# Altium schematic sheet 3s_BMS.SchDoc
size A4; SheetNumber: 1; SheetTotal: 2
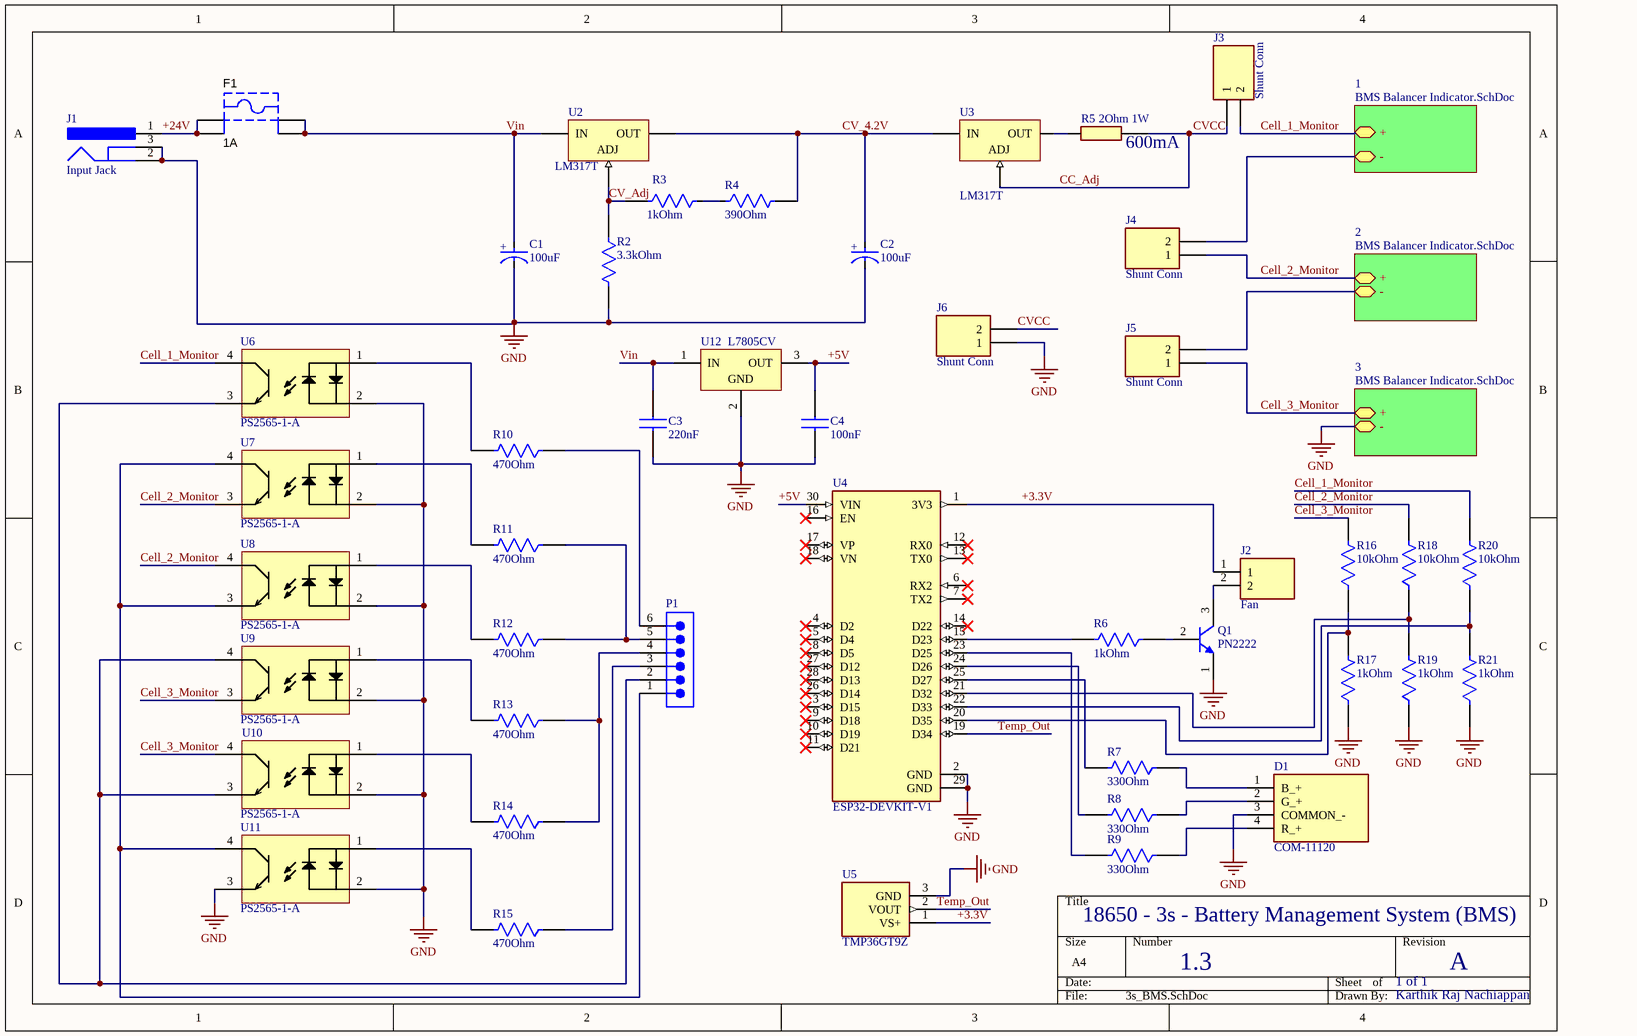
[diagram p0: 3s_BMS.SchDoc]

## Parts
C1  100uF  [FP-RAD-TH-D_8_0_5-L_11_5-MFG]
C2  100uF  [FP-RAD-TH-D_8_0_5-L_11_5-MFG]
C3  220nF  [K224K20X7RF5TH5]
C4  100nF  [C322C104K1R5TA]
D1  COM-11120  [COM11120]
F1  1A  [KSTN-3557-2]
J1  Input Jack  [CUI-PJ-002A_V]
J2  Fan  [HDRV2W67P0X254_1X2_467X234X823P]
J3  Shunt Conn  [HDRV2W67P0X254_1X2_467X234X823P]
J4  Shunt Conn  [HDRV2W67P0X254_1X2_467X234X823P]
J5  Shunt Conn  [HDRV2W67P0X254_1X2_467X234X823P]
J6  Shunt Conn  [HDRV2W67P0X254_1X2_467X234X823P]
P1  (no value)  [SMTC-TSW-106-07-X-S]
Q1  PN2222  [FAIR-TO-92-3]
R2  3.3kOhm  [FP-MRS25-MFG]
R3  1kOhm  [FP-MRS25-MFG]
R4  390Ohm  [FP-MRS25-MFG]
R5  2Ohm 1W  [RESAD1650W63L650D250]
R6  1kOhm  [FP-MRS25-MFG]
R7  330Ohm  [FP-MRS25-MFG]
R8  330Ohm  [FP-MRS25-MFG]
R9  330Ohm  [FP-MRS25-MFG]
R10  470Ohm  [FP-MRS25-MFG]
R11  470Ohm  [FP-MRS25-MFG]
R12  470Ohm  [FP-MRS25-MFG]
R13  470Ohm  [FP-MRS25-MFG]
R14  470Ohm  [FP-MRS25-MFG]
R15  470Ohm  [FP-MRS25-MFG]
R16  10kOhm  [FP-MRS25-MFG]
R17  1kOhm  [FP-MRS25-MFG]
R18  10kOhm  [FP-MRS25-MFG]
R19  1kOhm  [FP-MRS25-MFG]
R20  10kOhm  [FP-MRS25-MFG]
R21  1kOhm  [FP-MRS25-MFG]
U2  LM317T  [TO-220]
U3  LM317T  [TO-220]
U4  ESP32-DEVKIT-V1  [MODULE_ESP32_DEVKIT_V1]
U5  TMP36GT9Z  [TO-92]
U6  PS2565-1-A  [DIP762W50P254L460H455Q4B]
U7  PS2565-1-A  [DIP762W50P254L460H455Q4B]
U8  PS2565-1-A  [DIP762W50P254L460H455Q4B]
U9  PS2565-1-A  [DIP762W50P254L460H455Q4B]
U10  PS2565-1-A  [DIP762W50P254L460H455Q4B]
U11  PS2565-1-A  [DIP762W50P254L460H455Q4B]
U12  L7805CV  [TO220]

## Sub-sheets
1 = BMS Balancer Indicator.SchDoc: + (bidir), - (bidir)
2 = BMS Balancer Indicator.SchDoc: + (bidir), - (bidir)
3 = BMS Balancer Indicator.SchDoc: + (bidir), - (bidir)

## Nets
GND: C1.1(C) C2.1(C) C3.2 C4.2(-) D1.3(COMMON_-) J1.2 J1.3 J6.1 Q1.1(E) R2.2 R17.1 R19.1 R21.1 U4.2(GND) U4.29(GND) U5.3(GND) U6.2(Cathode) U7.2(Cathode) U8.2(Cathode) U9.2(Cathode) U10.2(Cathode) U11.2(Cathode) U11.3(Emitter) U12.2(GND) ; sheet 3/-
+3.3V: J2.1 U4.1(3V3) U5.1(VS+)
+5V: C4.1(+) U4.30(VIN) U12.3(OUT)
+24V: F1.1 F1.2 J1.1
CC_Adj: J3.1 J6.2 R5.2 U3.1(ADJ)  [also labelled CVCC]
Cell_1_Monitor: J3.2 R20.2 U6.4(Collector) ; sheet 1/+
Cell_2_Monitor: J4.1 R18.2 U7.3(Emitter) U8.4(Collector) ; sheet 2/+
Cell_3_Monitor: J5.1 R16.2 U9.3(Emitter) U10.4(Collector) ; sheet 3/+
CV_4.2V: C2.2(A) R4.2 U2.2(OUT) U3.3(IN)
CV_Adj: R2.1 R3.1 U2.1(ADJ)
Temp_Out: U4.19(D34) U5.2(VOUT)
Vin: C1.2(A) C3.1 F1.3 F1.4 U2.3(IN) U12.1(IN)
NetD1_1: D1.1(B_+) R7.1
NetD1_2: D1.2(G_+) R8.1
NetD1_4: D1.4(R_+) R9.1
NetJ2_2: J2.2 Q1.3(C)
NetJ4_2: J4.2 ; sheet 1/-
NetJ5_2: J5.2 ; sheet 2/-
NetP1_1: P1.1 U7.4(Collector) U8.3(Emitter) U11.4(Collector)
NetP1_2: P1.2 U6.3(Emitter) U9.4(Collector) U10.3(Emitter)
NetP1_3: P1.3 R15.1
NetP1_4: P1.4 R13.1 R14.1
NetP1_5: P1.5 R11.1 R12.1
NetP1_6: P1.6 R10.1
NetQ1_2: Q1.2(B) R6.1
NetR3_2: R3.2 R4.1
NetR5_1: R5.1 U3.2(OUT)
NetR6_2: R6.2 U4.15(D23)
NetR7_2: R7.2 U4.25(D27)
NetR8_2: R8.2 U4.24(D26)
NetR9_2: R9.2 U4.23(D25)
NetR10_2: R10.2 U6.1(Anode)
NetR11_2: R11.2 U7.1(Anode)
NetR12_2: R12.2 U8.1(Anode)
NetR13_2: R13.2 U9.1(Anode)
NetR14_2: R14.2 U10.1(Anode)
NetR15_2: R15.2 U11.1(Anode)
NetR16_1: R16.1 R17.2 U4.20(D35)
NetR18_1: R18.1 R19.2 U4.21(D32)
NetR20_1: R20.1 R21.2 U4.22(D33)

Not connected (* = marked no-connect by the designer): U4 3(D15)* 4(D2)* 5(D4)* 6(RX2)* 7(TX2)* 8(D5)* 9(D18)* 10(D19)* 11(D21)* 12(RX0)* 13(TX0)* 14(D22)* 16(EN)* 17(VP)* 18(VN)* 26(D14)* 27(D12)* 28(D13)*

## Notes on the sheet
- (near R5) 600mA
- 18650 - 3s - Battery Management System (BMS)
- 1.3
- 1 of 1
- A
- Karthik Raj Nachiappan
- (in symbol CMP-05427-001978-1) +

## Library data of the parts
C1 C2 = CMP-05427-001978-1: Aluminum Electrolytic Capacitors (Radial Lead Type) 100uF ±20% 50V
C3 = K224K20X7RF5TH5: Capacitor; Manufacturer_Name: Vishay; Datasheet Link: http://www.vishay.com/docs/45171/kseries.pdf; Height: 5mm; Manufacturer_Part_Number: K224K20X7RF5TH5; Mouser Part Number: 594-K224K20X7RF5TH5; Mouser Price/Stock: https://www.mouser.co.uk/ProductDetail/Vishay-BC-Components/K224K20X7RF5TH5?qs=KmQY1egXJHzBG72dl6YDdg%3D%3D; Arrow Part Number: K224K20X7RF5TH5; Arrow Price/Stock: https://www.arrow.com/en/products/k224k20x7rf5th5/vishay
C4 = C322C104M5U5TA: Capacitor; Manufacturer_Name: KEMET; Datasheet Link: https://content.kemet.com/datasheets/KEM_C1051_GOLDMAX_Z5U.pdf; Height: 6.6mm; Manufacturer_Part_Number: C322C104M5U5TA; Mouser Part Number: 80-C322C104M5U; Mouser Price/Stock: https://www.mouser.co.uk/ProductDetail/KEMET/C322C104M5U5TA?qs=CDCeLP2tGBsLrnt3J6Fqow%3D%3D; Arrow Part Number: C322C104M5U5TA; Arrow Price/Stock: https://www.arrow.com/en/products/c322c104m5u5ta/kemet-corporation
D1 = COM-11120: LED; Manufacturer_Name: SparkFun; Datasheet Link: http://cdn.sparkfun.com/datasheets/Components/General/YSL-R1047CR4G3BW-F8.pdf; Height: 13mm; Manufacturer_Part_Number: COM-11120; Mouser Part Number: 474-COM-11120; Mouser Price/Stock: https://www.mouser.co.uk/ProductDetail/SparkFun/COM-11120?qs=WyAARYrbSnauAm%2FsFIz3Fw%3D%3D; Arrow Part Number: COM-11120; Arrow Price/Stock: https://www.arrow.com/en/products/com-11120/sparkfun-electronics?region=nac
F1 = CMP-2000-05461-1: FUSE HOLDER, PCB MOUNT, 500VAC, 20A, ROHS; Manufacturer: Keystone-Electronics; Number of Circuits: 1; Voltage: 500V; Fuseholder Type: Block; Fuse Type: Blade; Fuse Size: 0.43"Lx0.15"Wx0.64"H(10.92mmx3.81mmx16.25mm); For Use With/Related Products: ATC,ATO257,MINI897; Current Rating: 30A; Datasheet URL: http://datasheet.octopart.com/3557-2-Keystone-datasheet-15715937.pdf; Orientation: Vertical; Family: Fuseholders; Datasheet Version: Apr-13; Contact Finish: TinNickel; Mounting Type: PCB; Series: -; Category: CircuitProtection; Termination Style: PCPin; Contact Material: Brass; Manufacturer URL: http://www.keyelco.com/
J1 = CMP-2000-06895-2: Through Hole Right Angle DC Power Jack, 2.5 A, 2 mm Center Pin, 3 Position, -25 to 85 degC, RoHS, Bulk; Manufacturer: CUIInc.; Brand: CUI; Inside Contact Diameter: 2mm; Voltage Rating: 24V; Outside Contact Diameter: 6.5mm; Current Rating: 2.5A; Insulation Resistance: 50MOhms; Contact Gender: Male; Connector Type: DCPowerJack; Datasheet Version: Rev. 1.03, 04/2016; Housing Material: PolybutyleneTerephthalate(PBT); Operating Temperature Range: -25Cto+85C; Termination Style: ThroughHole; Product Category: DCPowerConnectors; Mounting Technology: ThroughHole; Mounting Style: ThroughHole; Factory Pack Quantity: 500; Contact Plating: Nickel; Package Reference: PJ-002A; Mounting Angle: Right; Package Description: 3-Pin Through Hole Device, Body 14.4 x 9 mm, Height 11 mm; Flammability Rating: UL94V-0; Manufacturer URL: http://www.cui.com/; Product: Jacks; Contact Material: Copper; Datasheet URL: http://www.cui.com/product/resource/pj-002a.pdf; RoHS: True
J2-J6 = 5-146277-2: Connector; Manufacturer_Name: TE Connectivity; Datasheet Link: https://www.te.com/commerce/DocumentDelivery/DDEController?Action=srchrtrv&DocNm=146277&DocType=Customer+Drawing&DocLang=English; Height: 8.23mm; Manufacturer_Part_Number: 5-146277-2; Mouser Part Number: 571-5-146277-2; Mouser Price/Stock: https://www.mouser.co.uk/ProductDetail/TE-Connectivity/5-146277-2?qs=bwpFY26eRVdSYoepUea0uA%3D%3D; Arrow Part Number: 5-146277-2; Arrow Price/Stock: https://www.arrow.com/en/products/5-146277-2/te-connectivity?region=nac
P1 = CMP-1024-00383-1: 0.025" SQ Post Header, Through-hole, Vertical, -55 to 125 degC, 2.54 mm Pitch, 6-Pin, Male, RoHS; Manufacturer: Samtec; PartNumber: TSW-106-07-G-S; Pitch: 2.54 mm; RoHS: True; ComponentLink1Description: Manufacturer URL; DatasheetVersion: F-214; Orientation: Vertical; ComponentLink1URL: http://www.samtec.com; ComponentLink3Description: Package Specification; ComponentLink2Description: Datasheet; PackageVersion: DM, 8/1988; PackageDescription: .025[0.64] SQ. Post Terminal Strip Assembly; PackageReference: TSW-106-07-X-S; Mounting Technology: Through-hole; Temperature Range: -55 to 125 degC; ComponentLink3URL: http://www.samtec.com/documents/webfiles/cpdf/TSW-XXX-XX-XXX-X-XX-XXX-MKT.pdf; ComponentLink2URL: http://www.samtec.com/documents/webfiles/pdf/TSW_TH.PDF
Q1 = CMP-2000-06911-1: NPN General-Purpose Amplifier, 40 V, -55 to 150 degC, 3-Pin TO-92, RoHS, Tape and Reel; Manufacturer: FairchildSemiconductor; Configuration: Single; Collector-Emitter Saturation Voltage: 1V; Collector- Emitter Voltage VCEO Max: 40V; Unit Weight: 0.008466oz; Maximum DC Collector Current: 1A; DC Collector/Base Gain hfe Min: 100; Emitter- Base Voltage VEBO: 6V; Maximum Power Dissipation: 625mW; DC Current Gain hFE Max: 300; Gain Bandwidth Product fT: 300MHz; Collector- Base Voltage VCBO: 75V; Mounting Style: ThroughHole; Package Description: 3-Pin Transistor Outline Package, Body Dia 4.79 mm, Pitch 2.6 mm; Mounting Technology: ThroughHole; RoHS: Details; Brand: FairchildSemiconductor; Minimum Operating Temperature: -55C; Package / Case: TO-92-3KinkedLead; Package Reference: TO-92; Series: PN2222; Packaging: Reel; Datasheet Version: Rev. 1.1.0, 07/2014; Datasheet URL: https://www.fairchildsemi.com/datasheets/PN/PN2222A.pdf; Maximum Operating Temperature: +150C; Transistor Polarity: NPN; Factory Pack Quantity: 2000; Manufacturer URL: https://www.fairchildsemi.com/; <PCN>: http://www.mouser.com/PCN/3.26.10LTBDFairchild.pdf; Product Category: BipolarTransistors-BJT
R2-R4 R6-R21 = CMP-02408-000051-1: RES 1K OHM 0.6W 1% AXIAL; Power Rating: 600mW; Lead Diameter: 0.6mm; Voltage Rating (DC): 350V; Resistance: 1kR; Temperature Coefficient: 50ppm/°C; Width: 2.5mm; Military Standard: Not; Package Quantity: 5000; Radiation Hardening: No; Case/Package: Axial; Resistance Tolerance: 1%; Resistor Type: Metal Film; Contact Plating: Tin; Length: 6.5mm; Lead Free: Lead Free; RoHS Compliant: Yes; Mount: Through Hole; Number of Pins: 2; Technology: THIN FILM; Voltage Rating: 350V; Min Operating Temperature: -55°C; Weight: 0.00776oz; Diameter: 2.5mm; Construction: Cylindrical; Series: MRS25; Tolerance: 1%; Packaging: Tape and Reel; Max Operating Temperature: 155°C; Max Power Dissipation: 600mW; Number of Terminations: 2; Termination: Axial
R5 = PR01000102008JR500: Resistor; Manufacturer_Name: Vishay; Datasheet Link: http://www.vishay.com/docs/28729/pr010203.pdf; Manufacturer_Part_Number: PR01000102008JR500; Mouser Part Number: 594-5073NW2R000J; Mouser Price/Stock: https://www.mouser.co.uk/ProductDetail/Vishay-BC-Components/PR01000102008JR500?qs=LCMWAU1DZcxktvb8nmcPfw%3D%3D
U2 U3 = CMP-0244-00444-1: 1.5A, 1.2V to 37V Adjustable Voltage Regulator, 3-Pin TO-220; PackageVersion: 2011; ComponentLink1URL: http://www.st.com; ComponentLink2URL: http://www.st.com/internet/com/TECHNICAL_RESOURCES/TECHNICAL_LITERATURE/DATASHEET/CD00000455.pdf; PackageDescription: TO, Thru-Hole, Vertical, Heatsink Mounted; 3 In-Line Leads; Pitch 2.54 mm; PackageReference: TO-220; ComponentLink1Description: Manufacturer URL; ComponentLink3URL: http://www.st.com/internet/com/TECHNICAL_RESOURCES/TECHNICAL_LITERATURE/PACKAGE_INFORMATION/CD00004649.pdf; DatasheetVersion: 1/11/2011; ComponentLink2Description: Datasheet; ComponentLink3Description: Package Specification
U4 = CMP-027-000000-1: Dual core, Wi-Fi: 2.4 GHz up to 150 Mbits/s,BLE (Bluetooth Low Energy) and legacy Bluetooth, 32 bits, Up to 240 MHz; MF: Do it; Pin Count: 30; Design Item ID: ESP32-DEVKIT-V1; Component Type: Standard; Availability: Not in stock; Check_prices: https://www.snapeda.com/parts/ESP32-DEVKIT-V1/Do+it/view-part/?ref=eda; MP: ESP32-DEVKIT-V1; Package: None; SnapEDA_Link: https://www.snapeda.com/parts/ESP32-DEVKIT-V1/Do+it/view-part/?ref=snap; Price: None; Value: *; Source: ESP32-DEVKIT-V1.SchLib
U5 = TMP36GT9Z: Thermistor; Manufacturer_Name: Analog Devices; Datasheet Link: https://datasheet.datasheetarchive.com/originals/distributors/SFDatasheet-4/sf-00085637.pdf; Manufacturer_Part_Number: TMP36GT9Z; Mouser Part Number: 584-TMP36GT9Z; Mouser Price/Stock: https://www.mouser.co.uk/ProductDetail/Analog-Devices/TMP36GT9Z?qs=WIvQP4zGanhT97N47MSoHw%3D%3D; Arrow Part Number: TMP36GT9Z; Arrow Price/Stock: https://www.arrow.com/en/products/tmp36gt9z/analog-devices?region=nac
U6-U11 = CMP-00572-25674254-1: PS2565-1-A Optocoupler AC-IN 1-CH Transistor DC-OUT 4-Pin PDIP Magazine; Number of Elements: 1; Isolation Voltage: 5kV; Collector Emitter Voltage (VCEO): 300mV; Forward Current: 80mA; Output Current per Channel: 50mA; Output Voltage: 80V; Current Transfer Ratio: 400%; Forward Voltage: 1.4V; Rise Time: 3µs; Max Power Dissipation: 150mW; RoHS: Compliant; Radiation Hardening: No; Case/Package: DIP; Mount: Through Hole; Number of Pins: 4; Number of Channels: 1; Min Operating Temperature: -55°C; Max Collector Current: 50mA; Number of Circuits: 1; Collector Emitter Saturation Voltage: 300mV; Max Input Current: 80mA; Lead Free: Lead Free; NexarPartId: 25674254; Power Dissipation: 150mW; Max Operating Temperature: 100°C
U12 = CMP-0244-00483-1: Positive Voltage Regulator, 5V, 3-Pin TO-220; PackageDescription: TO, Thru-Hole, Vertical, Heatsink Mounted; 3 In-Line Leads; Pitch 2.54 mm; ComponentLink2Description: Datasheet; PackageReference: TO220; ComponentLink3URL: http://www.st.com/internet/com/TECHNICAL_RESOURCES/TECHNICAL_LITERATURE/PACKAGE_INFORMATION/CD00004649.pdf; DatasheetVersion: 16/11/2011; ComponentLink1Description: Manufacturer URL; ComponentLink1URL: http://www.st.com; PackageVersion: ver3.0; ComponentLink3Description: Package Specification; ComponentLink2URL: http://www.st.com/internet/com/TECHNICAL_RESOURCES/TECHNICAL_LITERATURE/DATASHEET/CD00000444.pdf